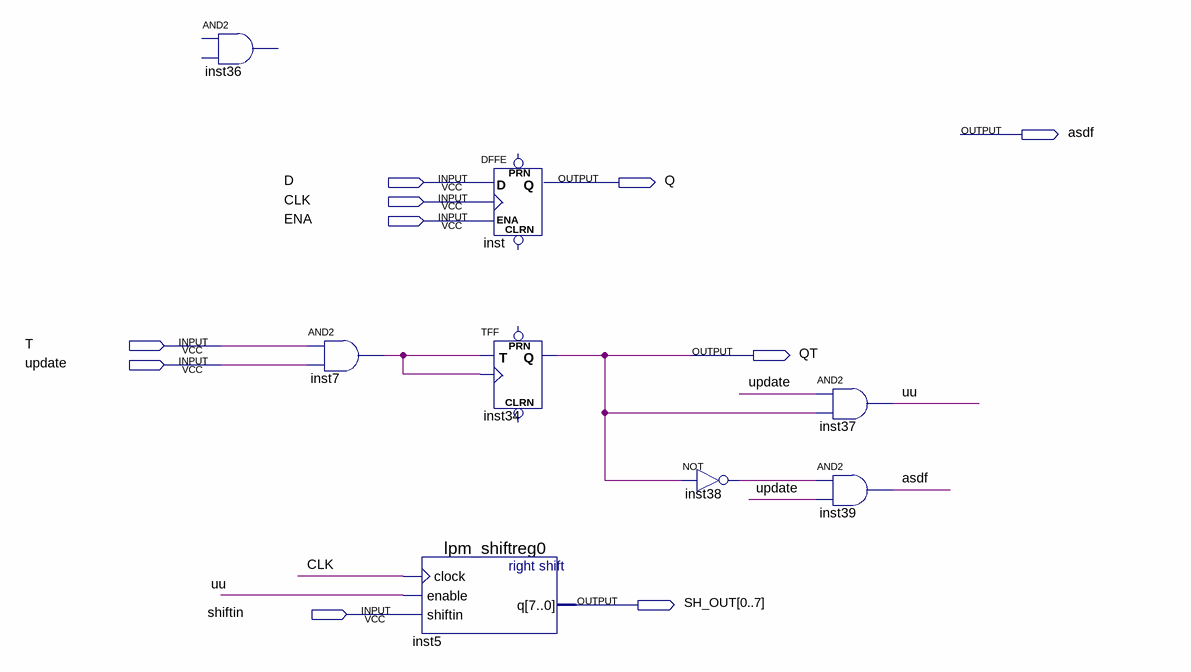
[diagram p0: schematic sheet]
// Quartus schematic FOR_BLOCK_TEST.bdf as structural Verilog: 8 symbols, 10 pins
module FOR_BLOCK_TEST (
  input  D,
  input  CLK,
  input  ENA,
  input  T,
  input  update,
  input  shiftin,
  output asdf,
  output Q,
  output QT,
  output [0:7] SH_OUT
);

  wire inst7_out, inst38_out, uu;

  // AND2 inst36 is placed but not wired
  and inst7 (inst7_out, T, update);
  lpm_shiftreg0 inst5 (.clock(CLK), .enable(uu), .shiftin(shiftin), .q(SH_OUT));
  DFFE inst (.D(D), .CLK(CLK), .ENA(ENA), .Q(Q));  // open: PRN, CLRN
  TFF inst34 (.T(inst7_out), .CLK(inst7_out), .Q(QT));  // open: PRN, CLRN
  not inst38 (inst38_out, QT);
  and inst37 (uu, update, QT);
  and inst39 (asdf, inst38_out, update);
endmodule
